# Altium project gps-barometer.PrjPcb
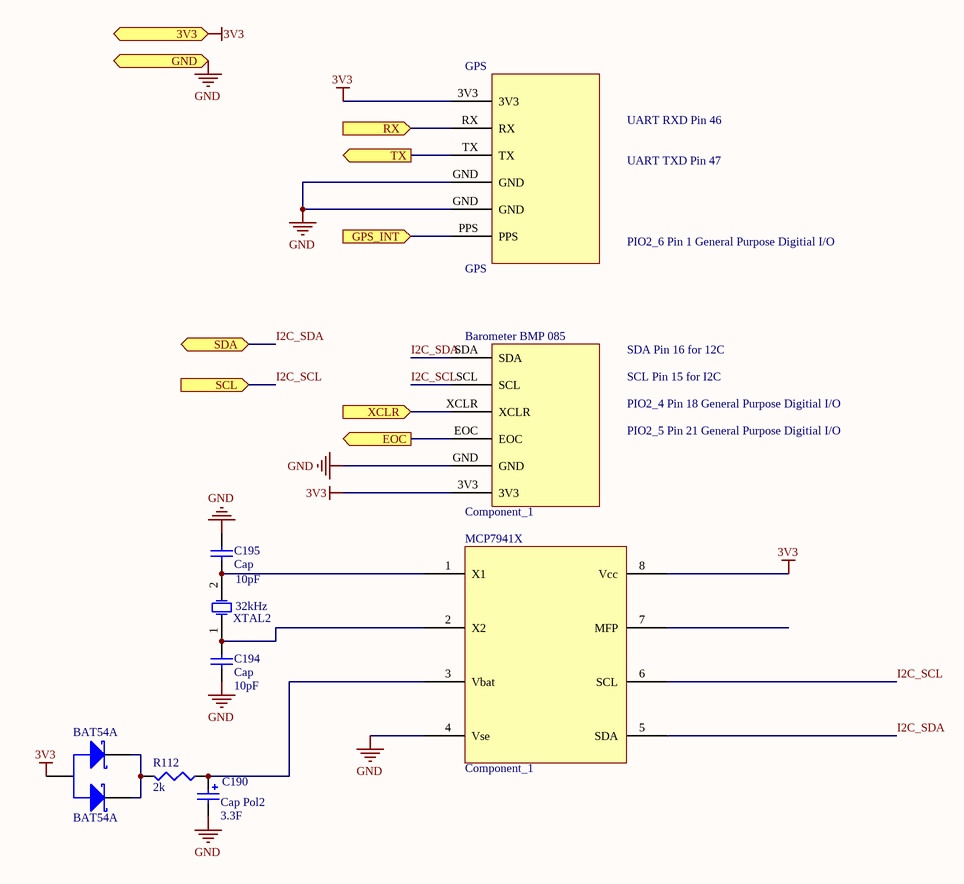
[diagram p0: GPSBarometer.SchDoc]
1 sheet, 9 parts. Net scope: flat (ports and power ports of the same name join across sheets).
Board files: CAN_faceplate.PcbDoc, CANFaceplate.PcbDoc, GPSBarometer.PcbDoc

## Sheet GPSBarometer.SchDoc
size A4

### Parts
32kHz  XTAL2  [WATCHA]
Barometer_BMP_085  Component_1  [PCBComponent_1]
BAT54A  BAT54A  [SOT23_2]
C190  Cap Pol2  value 3.3F  [SUPERCAP]
C194  Cap  C194: 10pF  [0603]
C195  Cap  value 10pF  [0603]
GPS  GPS  [GPS]
MCP7941X  Component_1  [SO8]
R112  2k  [0603]

### Ports
3V3 (in), EOC (out), GND (in), GPS_INT (in), RX (in), SCL (in), SDA (bidir), TX (out), XCLR (in)

### Nets
3V3: Barometer_BMP_085.3V3 BAT54A.3 GPS.3V3 MCP7941X.8(Vcc) ; port 3V3
GND: Barometer_BMP_085.GND C190.2 C194.1 C195.1 GPS.GND MCP7941X.4(Vse) ; port GND
I2C_SCL: Barometer_BMP_085.SCL MCP7941X.6(SCL) ; port SCL
I2C_SDA: Barometer_BMP_085.SDA MCP7941X.5(SDA) ; port SDA
Net32kHz_1: 32kHz.1(OSC1) C194.2 MCP7941X.2(X2)
Net32kHz_2: 32kHz.2(OSC2) C195.2 MCP7941X.1(X1)
NetBarometer_BMP_085_EOC: Barometer_BMP_085.EOC ; port EOC
NetBarometer_BMP_085_XCLR: Barometer_BMP_085.XCLR ; port XCLR
NetBAT54A_1: BAT54A.1 BAT54A.2 R112.2
NetC190_1: C190.1 MCP7941X.3(Vbat) R112.1
NetGPS_PPS: GPS.PPS ; port GPS_INT
NetGPS_RX: GPS.RX ; port RX
NetGPS_TX: GPS.TX ; port TX

Not connected (* = marked no-connect by the designer): MCP7941X 7(MFP)

### Notes on the sheet
- UART RXD Pin 46
- UART TXD Pin 47
- PIO2_6 Pin 1 General Purpose Digitial I/O
- SDA Pin 16 for 12C
- SCL Pin 15 for I2C
- PIO2_4 Pin 18 General Purpose Digitial I/O
- PIO2_5 Pin 21 General Purpose Digitial I/O

### Library data of the parts
32kHz = XTAL: Crystal Oscillator; Published: 8-Jun-2000; LatestRevisionDate: 17-Jul-2002; LatestRevisionNote: Re-released for DXP Platform.; PackageReference: R38; Publisher: Altium Limited
C190 = Cap Pol2: Polarized Capacitor (Axial); Published: 8-Jun-2000; LatestRevisionDate: 17-Jul-2002; LatestRevisionNote: Re-released for DXP Platform.; PackageReference: POLAR0.8; Publisher: Altium Limited
C194 C195 = Cap: Capacitor; Published: 8-Jun-2000; LatestRevisionDate: 17-Jul-2002; LatestRevisionNote: Re-released for DXP Platform.; PackageReference: RAD-0.3; Publisher: Altium Limited
R112 = RES1: Resistor; Value: 20k; Needed?: NO - HW LAB